# Altium schematic sheet ultrasonic_tank_monitor.SchDoc
size A4; SheetNumber: 1; SheetTotal: 3
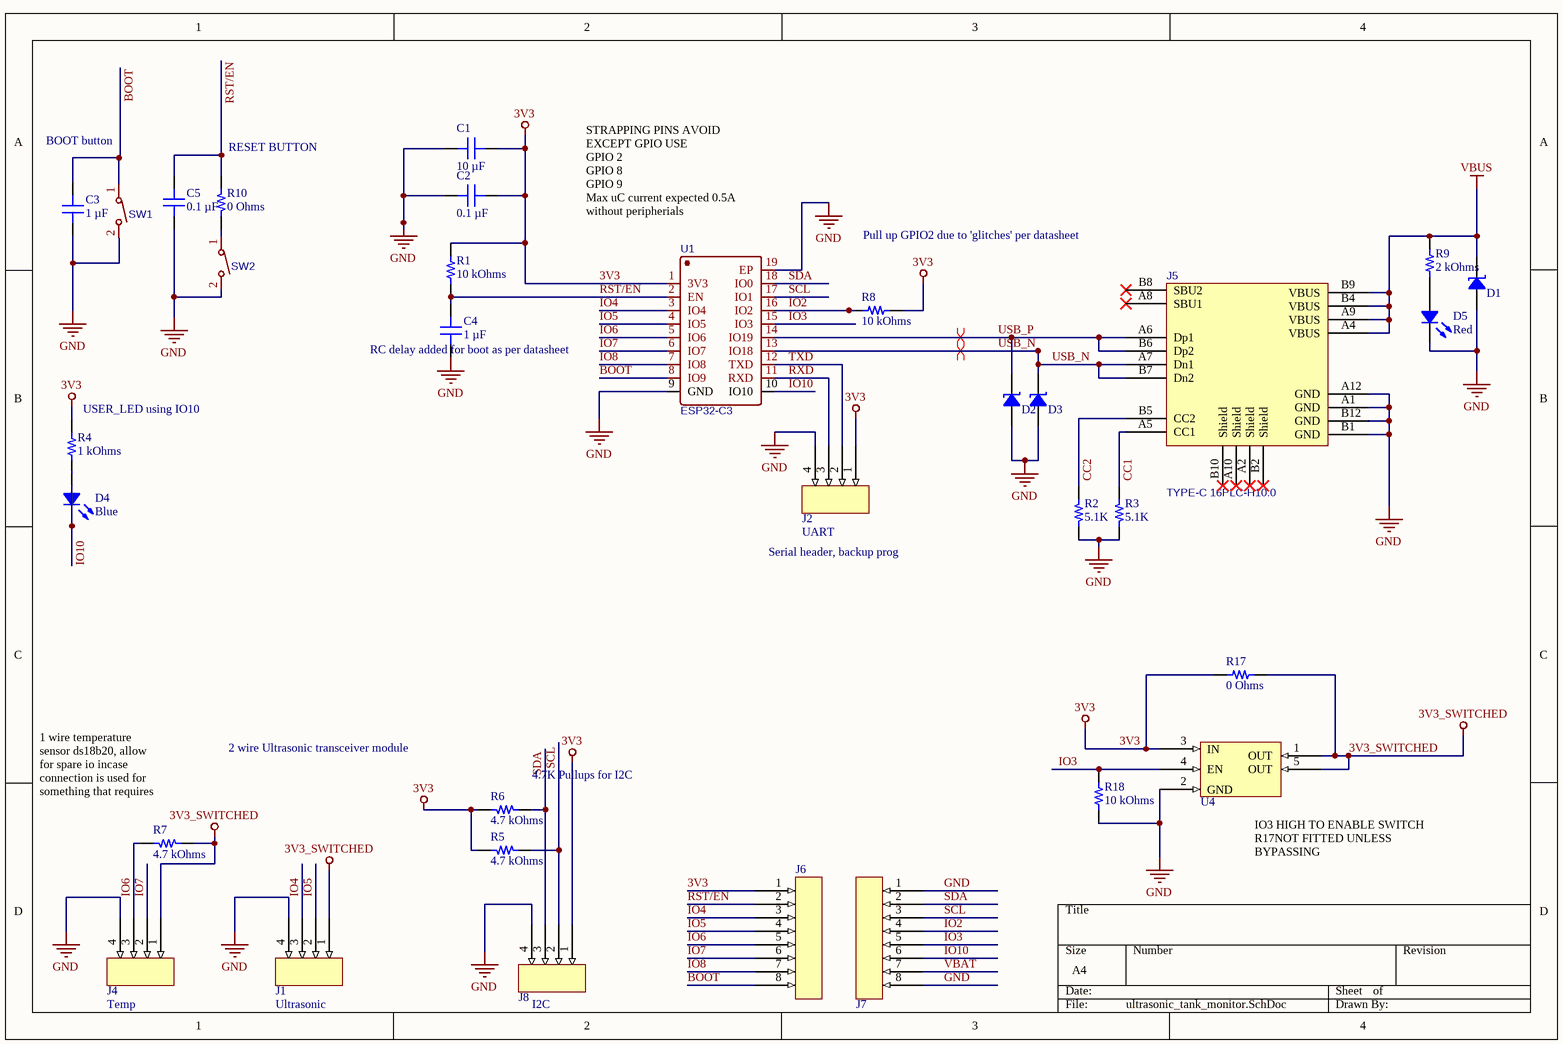
[diagram p0: ultrasonic_tank_monitor.SchDoc]

## Parts
C1  10 µF  [CAP 0603_1608]
C2  0.1 µF  [CAP 0603_1608]
C3  1 µF  [CAP 0603_1608]
C4  1 µF  [CAP 0603_1608]
C5  0.1 µF  [CAP 0603_1608]
D1  VESD16C1-02V-G3-08  [SOD523F]  (value not drawn)
D2  VESD16C1-02V-G3-08  [SOD523F]  (value not drawn)
D3  VESD16C1-02V-G3-08  [SOD523F]  (value not drawn)
D4  Blue  [LED 0805_2012 BLUE]
D5  Red  [LED 0805_2012 RED]
J1  Ultrasonic  [HDR-TH_4P-P2.54-V-M]
J2  UART  [HDR-TH_4P-P2.54-V-M]
J4  Temp  [HDR-TH_4P-P2.54-V-M]
J5  TYPE-C 16PLC-H10.0  [TYPE-C-TH_16PLC-H10.0]
J6  HDR-TH_8P-P2.54  [HDR-TH_8P-P2.54-V-M]  (value not drawn)
J7  HDR-TH_8P-P2.54  [HDR-TH_8P-P2.54-V-M]  (value not drawn)
J8  I2C  [HDR-TH_4P-P2.54-V-M]
R1  10 kOhms  [RES 0603_1608]
R2  5.1K  [RES 0603_1608]
R3  5.1K  [RES 0603_1608]
R4  1 kOhms  [RES 0603_1608]
R5  4.7 kOhms  [RES 0603_1608]
R6  4.7 kOhms  [RES 0603_1608]
R7  4.7 kOhms  [RES 0603_1608]
R8  10 kOhms  [RES 0603_1608]
R9  2 kOhms  [RES 0603_1608]
R10  0 Ohms  [RES 0603_1608]
R17  0 Ohms  [RES 1206_3216]
R18  10 kOhms  [RES 0603_1608]
SW1  TS-1185-B-A-B-A  [SW-SMD_L4.0-W3.0-LS5.0]  (value not drawn)
SW2  TS-1185-B-A-B-A  [SW-SMD_L4.0-W3.0-LS5.0]  (value not drawn)
U1  ESP32-C3  [BULETM-SMD_ESPRESSIF_ESP32-C3-WROOM-02-N4-4MB]
U4  AP22818AKBWT-7  [SOT-23-5_L2.9-W1.6-P0.95-LS2.8-BR]  (value not drawn)

## Nets
3V3: C1.2 C2.2 J2.1 J6.1 J8.1 R1.1 R4.2 R5.2 R6.2 R8.2 R17.1 U1.1(3V3) U4.3(IN)
3V3_SWITCHED: J1.1 J4.1 R7.1 R17.2 U4.1(OUT) U4.5(OUT)
GND: C1.1 C2.1 C3.1 C4.1 C5.1 D1.1 D2.1 D3.1 D5.2 J1.4 J2.4 J4.4 J5.A1(GND) J5.A12(GND) J5.B1(GND) J5.B12(GND) J7.1 J7.8 J8.4 R2.1 R3.1 R18.2 SW1.2 SW2.2 U1.9(GND) U1.19(EP) U4.2(GND)
VBUS: D1.2 J5.A4(VBUS) J5.A9(VBUS) J5.B4(VBUS) J5.B9(VBUS) R9.2
BOOT: C3.2 J6.8 SW1.1 U1.8(IO9)
CC1: J5.A5(CC1) R3.2
CC2: J5.B5(CC2) R2.2
IO2: J7.4 R8.1 U1.16(IO2)
IO3: J7.5 R18.1 U1.15(IO3) U4.4(EN)
IO4: J1.3 J6.3 U1.3(IO4)
IO5: J1.2 J6.4 U1.4(IO5)
IO6: J4.3 J6.5 R7.2 U1.5(IO6)
IO7: J4.2 J6.6 U1.6(IO7)
IO8: J6.7 U1.7(IO8)
IO10: D4.2 J7.6 U1.10(IO10)
RST/EN: C4.2 C5.2 J6.2 R1.2 R10.2 U1.2(EN)
RXD: J2.3 U1.11(RXD)
SCL: J7.3 J8.2 R5.1 U1.17(IO1)
SDA: J7.2 J8.3 R6.1 U1.18(IO0)
TXD: J2.2 U1.12(TXD)
USB_N: D3.2 J5.A7(Dn1) J5.B7(Dn2) U1.13(IO18)
USB_P: D2.2 J5.A6(Dp1) J5.B6(Dp2) U1.14(IO19)
VBAT: J7.7
NetD4_1: D4.1 R4.1
NetD5_1: D5.1 R9.1
NetR10_1: R10.1 SW2.1

Not connected (* = marked no-connect by the designer): J5 A2(Shield)* A8(SBU1)* A10(Shield)* B2(Shield)* B8(SBU2)* B10(Shield)*

## Layout directives
differential pair: USB_N, USB_P

## Notes on the sheet
- BOOT button
- (near R10) RESET BUTTON
- (near U1) STRAPPING PINS AVOID EXCEPT GPIO USE
  GPIO 2
  GPIO 8
  GPIO 9
  Max uC current expected 0.5A without peripherials
- Pull up GPIO2 due to 'glitches' per datasheet
- (near C4) RC delay added for boot as per datasheet
- (near R4) USER_LED using IO10
- Serial header, backup prog
- (near R7) 1 wire temperature sensor ds18b20, allow for spare io incase connection is used for something that requires 2 wire
- 2 wire Ultrasonic transceiver module
- (near R6) 4.7K Pullups for I2C
- (near U4) IO3 HIGH TO ENABLE SWITCH
  R17NOT FITTED UNLESS BYPASSING

## Library data of the parts
C1 = GRM188R61A106ME69D: CAP CER 10UF 10V X5R 0603; manufacturer: Murata Electronics; Tolerance: ±20%; Part Number: GRM188R61A106ME69D; Value: 10 µF; Applications: General Purpose; Capacitance: 10 µF; componentlink1description: Datasheet; componentlink1url: https://search.murata.co.jp/Ceramy/image/img/A01X/G101/ENG/GRM188R61A106ME69-01.pdf; componentlink2description: DigiKey Link; componentlink2url: https://www.digikey.com/en/products/detail/murata-electronics/GRM188R61A106ME69D/5027560; Device Package: 0603 (1608 Metric); lastupdated: 3/06/2023 7:12:12 PM; Lifecycle Status: Active; Minimum Order: 1; Mounting Type: Surface Mount, MLCC; Operating Temperature: -55°C ~ 85°C; Package / Case: 0603 (1608 Metric); packaging: TapeAndReel; partid: 11157; Part Status: Active; price: 0.01; series: GRM; Size / Dimension: 0.063" L x 0.031" W (1.60mm x 0.80mm); Supplier 1: DigiKey; Supplier Part Number 1: 490-10475-1-ND; Temperature Coefficient: X5R; Thickness (Max): 0.037" (0.95mm); Voltage - Rated: 10V
C2 C5 = VJ0603Y104MXQCW1BC: CAP CER 0.1UF 10V X7R 0603; manufacturer: Vishay Vitramon; Tolerance: ±20%; Part Number: VJ0603Y104MXQCW1BC; Value: 0.1 µF; Applications: General Purpose; Capacitance: 0.1 µF; componentlink1description: Datasheet; componentlink1url: https://www.vishay.com/docs/28548/vjw1bcbascomseries.pdf; componentlink2description: DigiKey Link; componentlink2url: https://www.digikey.com/en/products/detail/vishay-vitramon/VJ0603Y104MXQCW1BC/8305323; Device Package: 0603 (1608 Metric); lastupdated: 3/06/2023 7:11:16 PM; Lifecycle Status: Active; Minimum Order: 1; Mounting Type: Surface Mount, MLCC; Operating Temperature: -55°C ~ 125°C; Package / Case: 0603 (1608 Metric); packaging: TapeAndReel; partid: 34594; Part Status: Active; price: 0.01; series: VJ W1BC; Size / Dimension: 0.063" L x 0.031" W (1.60mm x 0.80mm); Supplier 1: DigiKey; Supplier Part Number 1: 720-VJ0603Y104MXQCW1BCCT-ND; Temperature Coefficient: X7R; Thickness (Max): 0.034" (0.87mm); Voltage - Rated: 10V
C3 C4 = LMK107B7105KAHT: CAP CER 1UF 10V X7R 0603; manufacturer: Taiyo Yuden; Tolerance: ±10%; Part Number: LMK107B7105KAHT; Value: 1 µF; Applications: Automotive; Capacitance: 1 µF; componentlink1description: Datasheet; componentlink1url: https://ds.yuden.co.jp/TYCOMPAS/ut/detail?pn=LMK107B7105KAHT  &u=M; componentlink2description: DigiKey Link; componentlink2url: https://www.digikey.com/en/products/detail/taiyo-yuden/LMK107B7105KAHT/4157759; Device Package: 0603 (1608 Metric); Lifecycle Status: Active; Minimum Order: 1; Mounting Type: Surface Mount, MLCC; Operating Temperature: -55°C ~ 125°C; Package / Case: 0603 (1608 Metric); packaging: TapeAndReel; partid: 13032; Part Status: Active; price: 0.01; Ratings: AEC-Q200; series: M; Size / Dimension: 0.063" L x 0.031" W (1.60mm x 0.80mm); Supplier 1: DigiKey; Supplier Part Number 1: 587-3410-1-ND; Temperature Coefficient: X7R; Thickness (Max): 0.035" (0.90mm); Voltage - Rated: 10V
  C3: lastupdated: 17/09/2023 7:08:58 PM
  C4: lastupdated: 3/06/2023 7:12:07 PM
D1-D3 = VESD16C1-02V-G3-08: ESD PROTECTION DIODE SOD-523; Manufacturer: Vishay Semiconductor Diodes Division; Capacitance @ Frequency: 27pF @ 1MHz; Current - Peak Pulse (10/1000µs): 3.6A (8/20µs); Power Line Protection: No; Power - Peak Pulse: 100W; Type: Zener; Unidirectional Channels: 1; Voltage - Breakdown (Min): 17V; Voltage - Clamping (Max) @ Ipp: 28V; Voltage - Reverse Standoff (Typ): 16V (Max); Part Number: VESD16C1-02V-G3-08; Applications: Automotive; ComponentLink1Description: Datasheet; ComponentLink1URL: http://www.vishay.com/docs/86130/vesd01c1-02vtovesd33c1-02v.pdf; ComponentLink2Description: DigiKey Link; ComponentLink2URL: http://digikey.com/product-detail/en/vishay-semiconductor-diodes-division/VESD16C1-02V-G3-08/VESD16C1-02V-G3-08GICT-ND/9948019; LastUpdated: 14/08/2023 8:59:27 PM; Lifecycle Status: Active; Minimum Order: 1; Mounting Type: Surface Mount; Operating Temperature: -55°C ~ 150°C (TJ); Package / Case: SC-79, SOD-523; Packaging: TapeAndReel; PartId: 9731; Part Status: Active; Price: 0.06; Series: Automotive, AEC-Q101; Supplier 1: DigiKey; Supplier Part Number 1: VESD16C1-02V-G3-08GICT-ND; Supplier Device Package: SOD-523
D4 = 5973605607F: LED BLUE 0805 SMD; Manufacturer: Dialight; Configuration: Standard; Current - Test: 2mA; Lens Color: 0.93mm; Lens Size: 1.40mm x 1.25mm; Lens Style: Rectangle with Flat Top; Millicandela Rating: 15mcd; Viewing Angle: 130°; Voltage - Forward (Vf) (Typ): 2.8V; Wavelength - Peak: 468nm; Part Number: 5973605607F; Color: Blue; ComponentLink1Description: Datasheet; ComponentLink1URL: http://www.dialightsignalsandcomponents.com/Assets/Drawings/2D_Drawings_DrawingDetailedSpec/NewDrawings/18375A.pdf; ComponentLink2Description: DigiKey Link; ComponentLink2URL: https://www.digikey.com/en/products/detail/dialight/5973605607F/9385449; Device Package: 0805 (2012 Metric); Height (Max): 1.10mm; LastUpdated: 14/08/2023 8:25:57 PM; Lifecycle Status: Active; Minimum Order: 1; Mounting Type: Surface Mount; Package / Case: 0805 (2012 Metric); Packaging: TapeAndReel; PartId: 760; Part Status: Active; Price: 0.08; Series: 597; Size / Dimension: 2.00mm L x 1.25mm W; Supplier 1: DigiKey; Supplier Part Number 1: 350-4394-1-ND; Supplier Device Package: 0805; Value: Blue
D5 = 5990110007F: LED RED 0805 SMD; Manufacturer: Dialight; Configuration: Standard; Current - Test: 20mA; Lens Color: 0.80mm; Lens Size: 1.40mm x 1.25mm; Lens Style: Rectangle with Flat Top; Millicandela Rating: 29mcd; Viewing Angle: 140°; Voltage - Forward (Vf) (Typ): 2.1V; Wavelength - Dominant: 633nm; Part Number: 5990110007F; Color: Red; ComponentLink1Description: Datasheet; ComponentLink1URL: http://www.dialightsignalsandcomponents.com/Assets/Brochures_And_Catalogs/Indication/CBI_SMD_new/Dialight_CBI_data_599-0805_Apr2018.pdf; ComponentLink2Description: DigiKey Link; ComponentLink2URL: https://www.digikey.com/en/products/detail/dialight/5990110007F/9385408; Device Package: 0805 (2012 Metric); Height (Max): 0.80mm; LastUpdated: 15/06/2023 8:27:56 PM; Lifecycle Status: Active; Minimum Order: 1; Mounting Type: Surface Mount; Package / Case: 0805 (2012 Metric); Packaging: TapeAndReel; PartId: 308; Part Status: Active; Price: 0.04; Series: 599; Size / Dimension: 2.00mm L x 1.25mm W; Supplier 1: DigiKey; Supplier Part Number 1: 350-4353-1-ND; Supplier Device Package: 0805; Value: Red
J1 J2 J4 J8 = HDR-TH_4P-P2.54
J5 = TYPE-C 16PLC-H10.0: Manufacturer: SHOU HAN(首韩); Contributor: lcsc; Supplier: LCSC; Supplier Part: C3151747; Manufacturer Part: TYPE-C 16PLC-H10.0; JLCPCB Part Class: Extended Part; spicePre: U; spiceSymbolName: TYPE-C 16PLC-H10.0
R1 R8 R18 = CRCW060310K0JNEB: RES SMD 10K OHM 5% 1/10W 0603; Manufacturer: Vishay Dale; Power (Watts): 0.1W, 1/10W; Temperature Coefficient: ±200ppm/°C; Part Number: CRCW060310K0JNEB; Value: 10 kOhms; ComponentLink1Description: Datasheet; ComponentLink1URL: http://www.vishay.com/docs/20035/dcrcwe3.pdf; ComponentLink2Description: DigiKey Link; ComponentLink2URL: https://www.digikey.com/en/products/detail/vishay-dale/CRCW060310K0JNEB/5070677; Composition: Thick Film; Device Package: 0603 (1608 Metric); Features: Automotive AEC-Q200; Height - Seated (Max): 0.020" (0.50mm); Lifecycle Status: Active; Minimum Order: 1; Number of Terminations: 2; Operating Temperature: -55°C ~ 155°C; Package / Case: 0603 (1608 Metric); Packaging: CutTape; PartId: 56621; Part Status: Active; Price: 0.01; Ratings: AEC-Q200; Resistance: 10 kOhms; Series: CRCW; Size / Dimension: 0.063" L x 0.033" W (1.60mm x 0.85mm); Supplier 1: DigiKey; Supplier Part Number 1: 541-CRCW060310K0JNEBCT-ND; Supplier Device Package: 0603; Tolerance: ±5%
  R1 R18: LastUpdated: 3/06/2023 7:37:02 PM
  R8: LastUpdated: 16/10/2023 7:33:33 PM
R2 R3 = RMEF0603JT5K10: RES 5.1K OHM 5% 1/10W 0603; Manufacturer: Stackpole Electronics Inc; Power (Watts): 0.1W, 1/10W; Ratings: 7C1 RoHS w/out Exemption (100% Pb-Free), AEC-Q200; Resistance: 5.1 kOhms; Temperature Coefficient: ±100ppm/°C; Part Number: RMEF0603JT5K10; Value: 5.1K; ComponentLink1Description: Datasheet; ComponentLink1URL: https://www.seielect.com/Catalog/SEI-RMEF.pdf; ComponentLink2Description: DigiKey Link; ComponentLink2URL: https://www.digikey.com/en/products/detail/stackpole-electronics-inc/RMEF0603JT5K10/16839740; Composition: Thick Film; Device Package: 0603 (1608 Metric); Features: Automotive AEC-Q200; Height - Seated (Max): 0.020" (0.50mm); LastUpdated: 22/08/2023 7:30:12 PM; Lifecycle Status: Active; Minimum Order: 1; Number of Terminations: 2; Operating Temperature: -55°C ~ 155°C; Package / Case: 0603 (1608 Metric); Packaging: TapeAndReel; PartId: 69491; Part Status: Active; Price: 0.01; Series: RMEF; Size / Dimension: 0.063" L x 0.031" W (1.60mm x 0.80mm); Supplier 1: DigiKey; Supplier Part Number 1: 738-RMEF0603JT5K10CT-ND; Supplier Device Package: 0603; Tolerance: ±5%
R4 = WR06X102 JTL: RES 1K OHM 5% 1/10W 0603; Manufacturer: Walsin Technology Corporation; Power (Watts): 0.1W, 1/10W; Temperature Coefficient: ±100ppm/°C; Part Number: WR06X102 JTL; Value: 1 kOhms; ComponentLink1Description: Datasheet; ComponentLink1URL: https://www.passivecomponent.com/wp-content/uploads/chipR/ASC_WR.pdf; ComponentLink2Description: DigiKey Link; ComponentLink2URL: https://www.digikey.com/en/products/detail/walsin-technology-corporation/WR06X102-JTL/13241138; Composition: Thick Film; Device Package: 0603 (1608 Metric); Height - Seated (Max): 0.024" (0.60mm); LastUpdated: 14/08/2023 7:39:30 PM; Lifecycle Status: Active; Minimum Order: 1; Number of Terminations: 2; Operating Temperature: -55°C ~ 155°C; Package / Case: 0603 (1608 Metric); Packaging: CutTape; PartId: 61985; Part Status: Active; Price: 0.01; Resistance: 1 kOhms; Series: WR; Size / Dimension: 0.063" L x 0.031" W (1.60mm x 0.80mm); Supplier 1: DigiKey; Supplier Part Number 1: 1292-WR06X102JTLCT-ND; Supplier Device Package: 0603; Tolerance: ±5%
R5-R7 = WR06X4701FTL: RES 4.7K OHM 1% 1/10W 0603; Manufacturer: Walsin Technology Corporation; Power (Watts): 0.1W, 1/10W; Temperature Coefficient: ±100ppm/°C; Part Number: WR06X4701FTL; Value: 4.7 kOhms; ComponentLink1Description: Datasheet; ComponentLink1URL: https://www.passivecomponent.com/wp-content/uploads/chipR/ASC_WR.pdf; ComponentLink2Description: DigiKey Link; ComponentLink2URL: https://www.digikey.com/en/products/detail/walsin-technology-corporation/WR06X4701FTL/13240840; Composition: Thick Film; Device Package: 0603 (1608 Metric); Height - Seated (Max): 0.024" (0.60mm); LastUpdated: 31/08/2023 7:31:34 PM; Lifecycle Status: Active; Minimum Order: 1; Number of Terminations: 2; Operating Temperature: -55°C ~ 155°C; Package / Case: 0603 (1608 Metric); Packaging: CutTape; PartId: 67913; Part Status: Active; Price: 0.01; Resistance: 4.7 kOhms; Series: WR; Size / Dimension: 0.063" L x 0.031" W (1.60mm x 0.80mm); Supplier 1: DigiKey; Supplier Part Number 1: 1292-WR06X4701FTLCT-ND; Supplier Device Package: 0603; Tolerance: ±1%
R9 = RC0603JR-102KL: RES 2K OHM 5% 1/10W 0603; Manufacturer: Yageo; Power (Watts): 0.1W, 1/10W; Temperature Coefficient: ±100ppm/°C; Part Number: RC0603JR-102KL; Value: 2 kOhms; ComponentLink1Description: Datasheet; ComponentLink1URL: https://www.yageo.com/upload/media/product/productsearch/datasheet/rchip/PYu-RC_Group_51_RoHS_L_11.pdf; ComponentLink2Description: DigiKey Link; ComponentLink2URL: https://www.digikey.com/en/products/detail/yageo/RC0603JR-102KL/14286411; Composition: Thick Film; Device Package: 0603 (1608 Metric); Height - Seated (Max): 0.022" (0.55mm); LastUpdated: 14/08/2023 7:39:28 PM; Lifecycle Status: Active; Minimum Order: 1; Number of Terminations: 2; Operating Temperature: -55°C ~ 155°C; Package / Case: 0603 (1608 Metric); Packaging: CutTape; PartId: 65479; Part Status: Active; Price: 0.01; Resistance: 2 kOhms; Series: RC_L; Size / Dimension: 0.063" L x 0.031" W (1.60mm x 0.80mm); Supplier 1: DigiKey; Supplier Part Number 1: 13-RC0603JR-102KLCT-ND; Supplier Device Package: 0603; Tolerance: ±5%
R10 = WR06X000 PTL: RES SMD 0.0 JUMPER 1/10W 0603; Manufacturer: Walsin Technology Corporation; Part Number: WR06X000 PTL; Value: 0 Ohms; ComponentLink2Description: DigiKey Link; ComponentLink2URL: https://www.digikey.com/en/products/detail/walsin-technology-corporation/WR06X000-PTL/5978108; Composition: Thick Film; Device Package: 0603 (1608 Metric); Height - Seated (Max): 0.024" (0.60mm); LastUpdated: 15/06/2023 7:41:49 PM; Lifecycle Status: Active; Minimum Order: 1; Number of Terminations: 2; Operating Temperature: -55°C ~ 155°C; Package / Case: 0603 (1608 Metric); Packaging: CutTape; PartId: 77887; Part Status: Active; Price: 0.01; Resistance: 0 Ohms; Series: WR; Size / Dimension: 0.063" L x 0.031" W (1.60mm x 0.80mm); Supplier 1: DigiKey; Supplier Part Number 1: 1292-WR06X000PTLCT-ND; Supplier Device Package: 0603; Tolerance: Jumper
R17 = RCL06120000Z0EA: RES SMD 0 OHM 3/4W 1206 WIDE; Manufacturer: Vishay Dale; Power (Watts): 0.75W, 3/4W; Tolerance: Jumper; Part Number: RCL06120000Z0EA; ComponentLink1Description: Datasheet; ComponentLink1URL: http://www.vishay.com/docs/20046/rcle3.pdf; ComponentLink2Description: DigiKey Link; ComponentLink2URL: https://www.digikey.com/en/products/detail/vishay-dale/RCL06120000Z0EA/2587612; Composition: Thick Film; Device Package: 1206 (3216 Metric); Features: Automotive AEC-Q200; Height - Seated (Max): 0.026" (0.65mm); LastUpdated: 17/09/2023 7:43:47 PM; Lifecycle Status: Active; Minimum Order: 1; Number of Terminations: 2; Operating Temperature: -55°C ~ 155°C; Package / Case: 1206 (3216 Metric); Packaging: TapeAndReel; PartId: 66283; Part Status: Active; Price: 0.02; Ratings: AEC-Q200; Resistance: 0 Ohms; Series: RCL; Size / Dimension: 0.063" L x 0.126" W (1.60mm x 3.20mm); Supplier 1: DigiKey; Supplier Part Number 1: RCL0.0CCT-ND; Supplier Device Package: 0612; Value: 0 Ohms
SW1 SW2 = TS-1185-B-A-B-A: Tactile Switch SMD 4x3x2 50mA; Manufacturer: XKB Connectivity(中国星坤); Contributor: LCSC; Supplier: LCSC; Supplier Part: C561517; Manufacturer Part: TS-1185-B-A-B-A; JLCPCB Part Class: Extended Part; spicePre: S; spiceSymbolName: TS-1185-B-A-B-A
U1 = ESP32-C3-WROOM-02-N4(4MB): Manufacturer: ESPRESSIF(乐鑫); Contributor: LCSC; Supplier: LCSC; Supplier Part: C2934560; Manufacturer Part: ESP32-C3-WROOM-02-N4; JLCPCB Part Class: Extended Part; spicePre: U; spiceSymbolName: ESP32-C3-WROOM-02-N4(4MB)
U4 = AP22818AKBWT-7: High active 2A load distribution switch